# EAGLE design 1705-Servo2 (EAGLE 8.3.2)
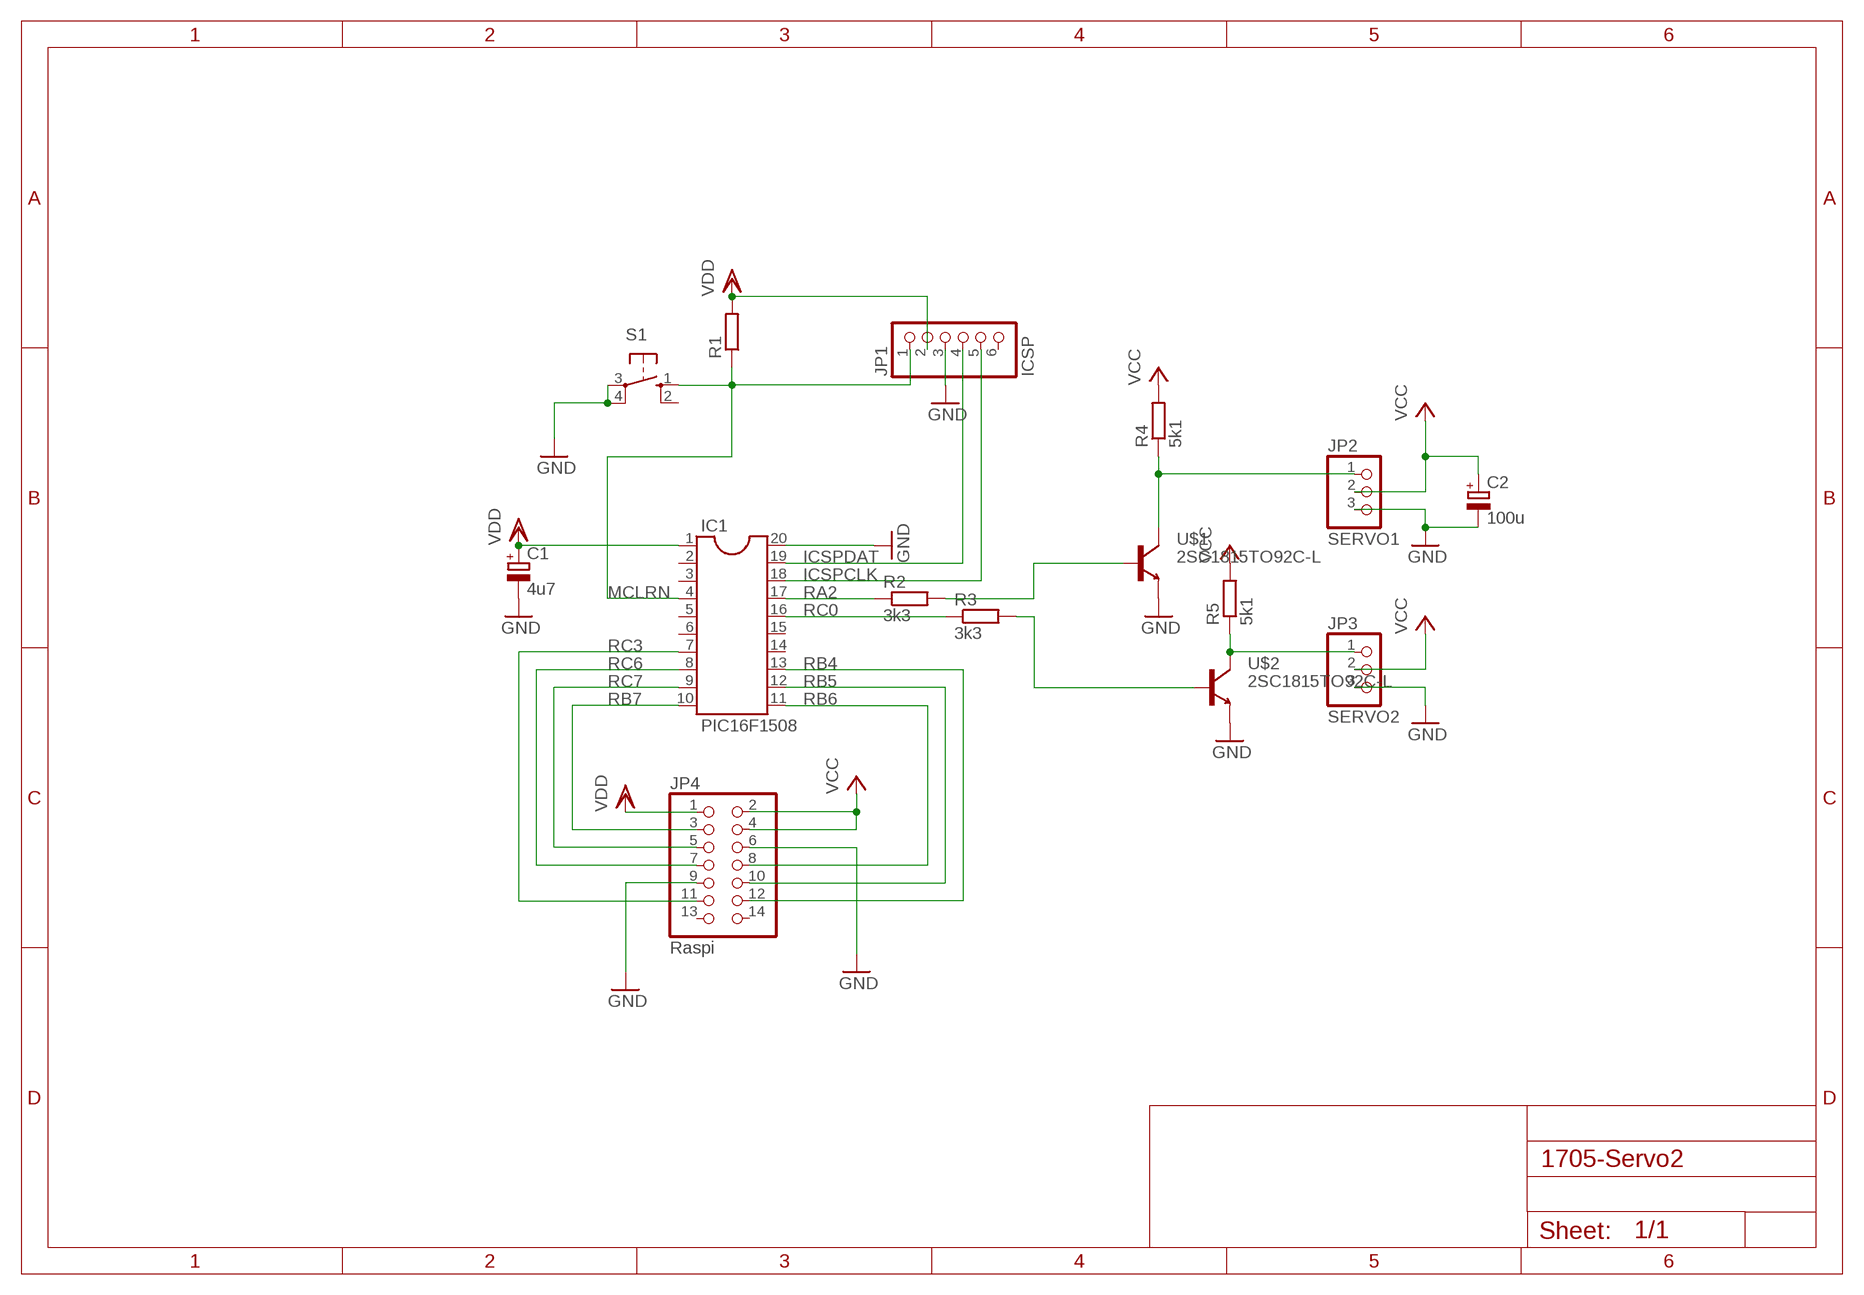
[diagram p0: schematic, sheet 1]

## Parts
C1  4u7  CPOL-EUE5-6E  [E5-6E]
C2  100u  CPOL-EUE2.5-6E  [E2,5-6E]
IC1  PIC16F1508  DIL20  [DIL20]
JP1  ICSP  PINHD-1X6  [1X06]
JP2  SERVO1  PINHD-1X3  [1X03]
JP3  SERVO2  PINHD-1X3  [1X03]
JP4  Raspi  PINHD-2X7  [2X07]
R1  R-EU_0207/2V  [0207/2V]
R2  3k3  R-EU_0204/8  [0204/8]
R3  3k3  R-EU_0204/8  [0204/8]
R4  5k1  R-EU_0207/2V  [0207/2V]
R5  5k1  R-EU_0207/2V  [0207/2V]
S1  10-XX  [B3F-10XX]
U$1  2SC1815TO92C-L  [TO92C-L]
U$2  2SC1815TO92C-L  [TO92C-L]

## Nets
GND: C1.- C2.- IC1.20 JP1.3 JP2.3 JP3.3 JP4.6 JP4.9 S1.3(P) S1.4(P1) U$1.1(E) U$2.1(E)
ICSPCLK: IC1.18 JP1.5
ICSPDAT: IC1.19 JP1.4
MCLRN: IC1.4 JP1.1 R1.1 S1.1(S)
N$5: JP2.1 R4.1 U$1.2(C)
N$6: JP3.1 R5.1 U$2.2(C)
N$7: R2.2 U$1.3(B)
N$8: R3.2 U$2.3(B)
RA2: IC1.17 R2.1
RB4: IC1.13 JP4.12
RB5: IC1.12 JP4.10
RB6: IC1.11 JP4.8
RB7: IC1.10 JP4.3
RC0: IC1.16 R3.1
RC3: IC1.7 JP4.11
RC6: IC1.8 JP4.7
RC7: IC1.9 JP4.5
VCC: C2.+ JP2.2 JP3.2 JP4.2 JP4.4 R4.2 R5.2
VDD: C1.+ IC1.1 JP1.2 JP4.1 R1.2
Unconnected: IC1.2 IC1.3 IC1.5 IC1.6 IC1.14 IC1.15 JP1.6 JP4.13 JP4.14 S1.2(S1)

## Library data of the parts
C1 C2 = mita-akiba:CPOL-EU: POLARIZED CAPACITOR, European symbol
IC1 = ic-package:DIL20: Dual In Line / Socket
JP1 = pinhead:PINHD-1X6: PIN HEADER
JP2 JP3 = pinhead:PINHD-1X3: PIN HEADER
JP4 = pinhead:PINHD-2X7: PIN HEADER
R1-R5 = mita-akiba:R-EU_*: RESISTOR, European symbol
S1 = switch-omron:10-XX: OMRON SWITCH; MPN: B3F-1000; OC_FARNELL: 176432; OC_NEWARK: 36M3542
U$1 U$2 = mita-akiba:2SC1815*: Toshiba VCEO=50V IC=150mA hFE rank: O 70-140, Y 120-240, GR 200-400, BL=350-700 Complementary to 2SA1015

## Board
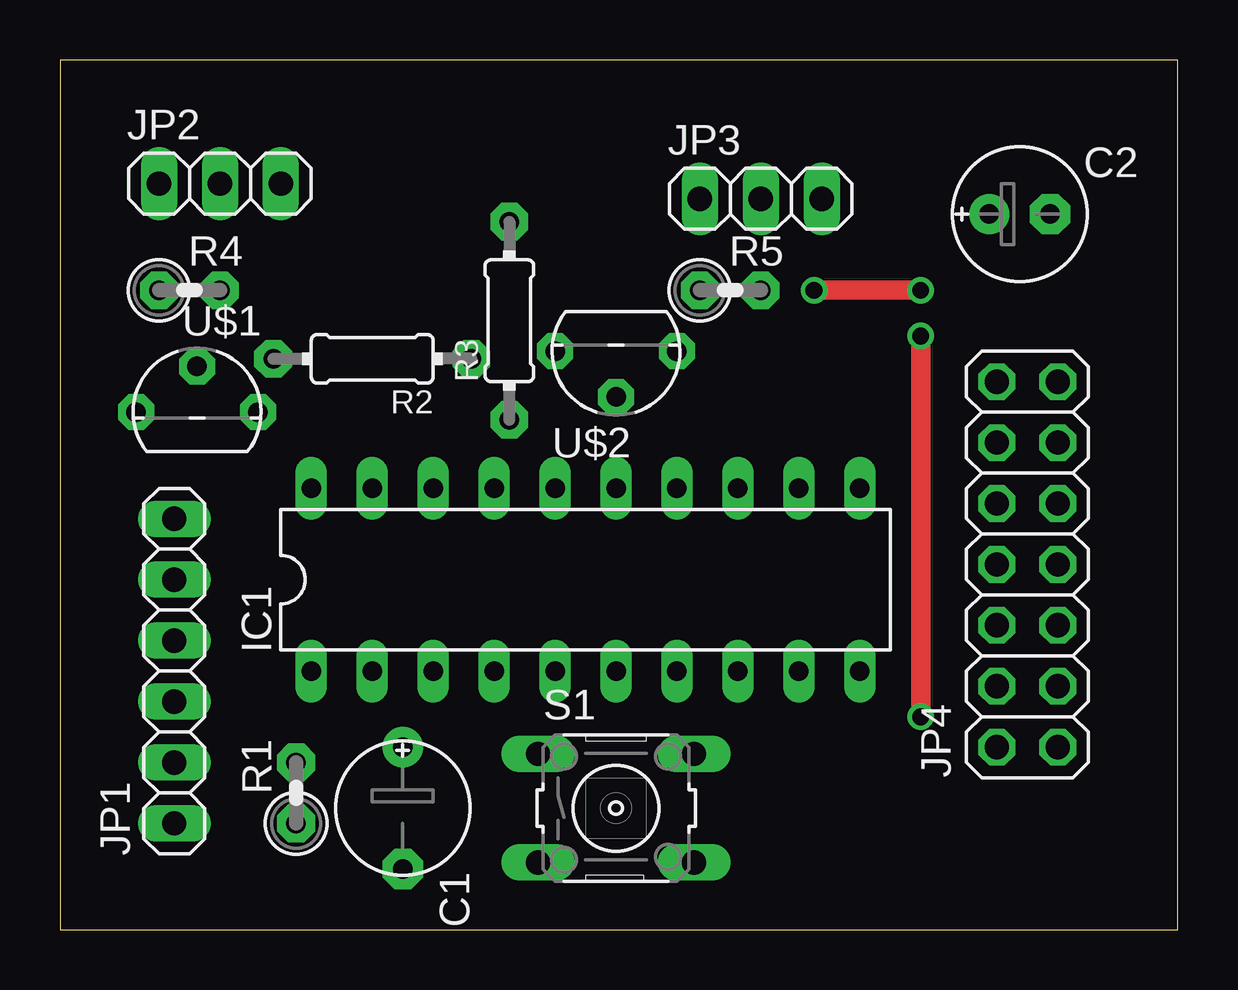
[diagram p1: board, top side]
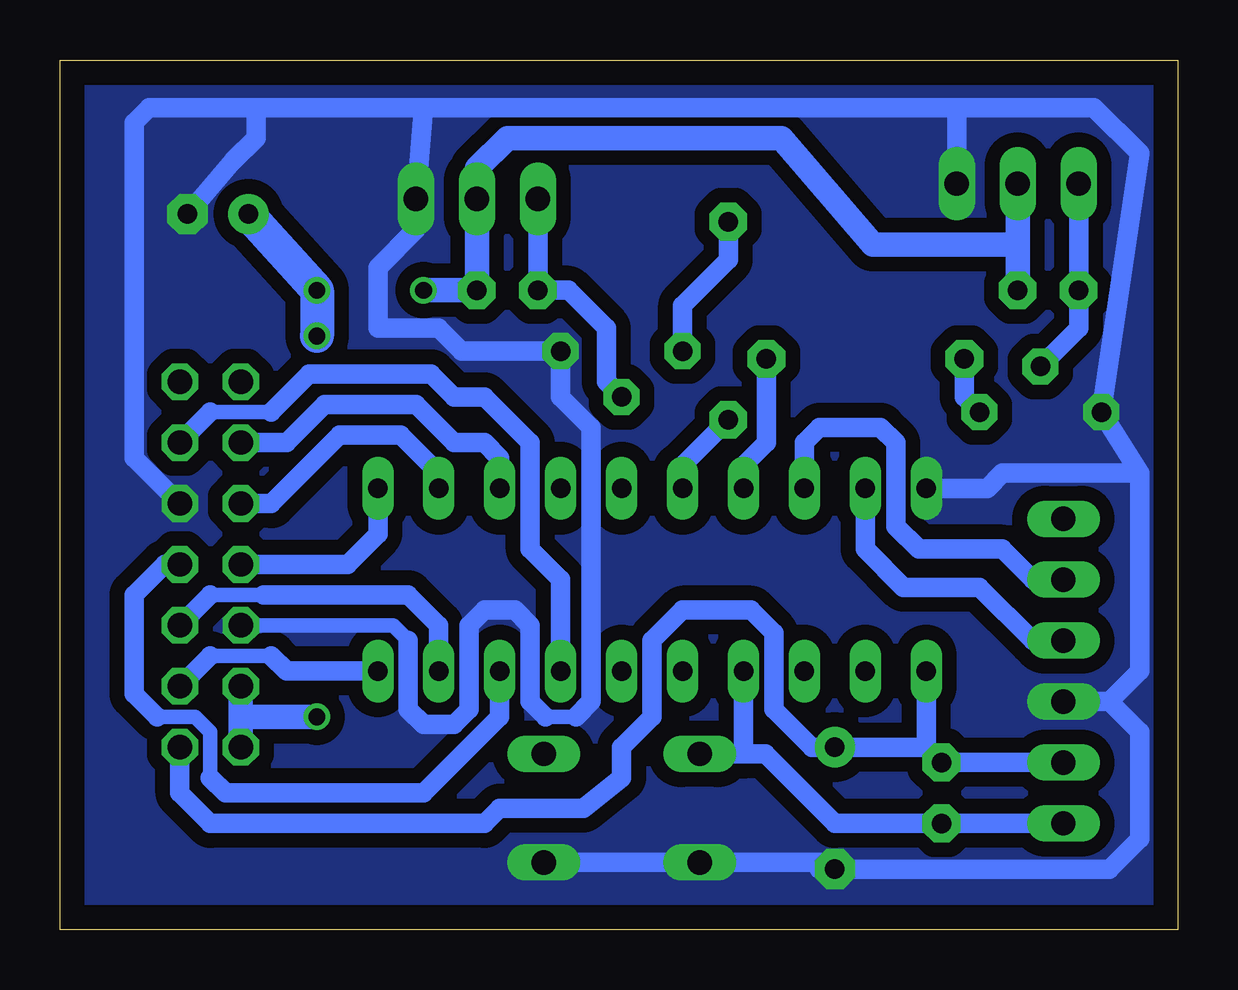
[diagram p2: board, bottom side, seen from below]

Size 46.59 x 36.27 mm. Coordinates in mm from the lower left corner, seen from the top.
Outline: 0,0 46.59,0 46.59,36.27 0,36.27 0,0
Copper layers (1*16): Top 0.035mm / dielectric 1.5mm / Bottom 0.035mm
Design rules "default": minimum track width 10mil, minimum drill 24mil, track to track 8mil, track to pad 8mil, pad to pad 8mil, via to via 8mil, smd to smd 8mil, copper to edge 40mil, drill to drill 8mil, minimum pad ring 10mil, minimum via ring 8mil, stop-mask expansion 4mil, vias tented up to drill 0mil, thermal gap 10mil

### Footprints (pad centres in the part's own frame; a part is rotated, then mirrored left to right if it is on the bottom)
E5-6E = drill 0.813 pad 1.676: + -2.54,0 | drill 0.813 pad 1.676 octagon: - 2.54,0
E2,5-6E = drill 0.813 pad 1.676: + -1.27,0 | drill 0.813 pad 1.676 octagon: - 1.27,0
DIL20 = drill 0.813 long: 1 -11.43,-3.81; 2 -8.89,-3.81; 3 -6.35,-3.81; 4 -3.81,-3.81; 5 -1.27,-3.81; 6 1.27,-3.81; 7 3.81,-3.81; 8 6.35,-3.81; 9 8.89,-3.81; 10 11.43,-3.81; 11 11.43,3.81; 12 8.89,3.81; 13 6.35,3.81; 14 3.81,3.81; 15 1.27,3.81; 16 -1.27,3.81; 17 -3.81,3.81; 18 -6.35,3.81; 19 -8.89,3.81; 20 -11.43,3.81
1X06 = drill 1.016 long: 1 -6.35,0; 2 -3.81,0; 3 -1.27,0; 4 1.27,0; 5 3.81,0; 6 6.35,0
1X03 = drill 1.016 long: 1 -2.54,0; 2 0,0; 3 2.54,0
2X07 = drill 1.016 octagon: 1 -7.62,-1.27; 2 -7.62,1.27; 3 -5.08,-1.27; 4 -5.08,1.27; 5 -2.54,-1.27; 6 -2.54,1.27; 7 0,-1.27; 8 0,1.27; 9 2.54,-1.27; 10 2.54,1.27; 11 5.08,-1.27; 12 5.08,1.27; 13 7.62,-1.27; 14 7.62,1.27
0207/2V = drill 0.813 pad 1.575 octagon: 1 -1.27,0; 2 1.27,0
0204/8 = drill 0.813 pad 1.575 octagon: 1 -4.128,0; 2 4.128,0
B3F-10XX = drill 1.016 long: 1 -3.251,2.261; 2 3.251,2.261; 3 -3.251,-2.261; 4 3.251,-2.261
TO92C-L = drill 0.813 pad 1.5 octagon: 1 -2.54,0; 2 0,1.905; 3 2.54,0

### Placement (x,y rotation side)
C1  14.29,5.08 270 top
C2  40,29.85 0 top
IC1  21.91,14.61 0 top
JP1  4.76,10.79 90 top
JP2  6.67,31.12 0 top
JP3  29.21,30.48 0 top
JP4  40.32,15.24 90 top
R1  9.84,5.71 90 top
R2  13.02,23.81 180 top
R3  18.73,25.4 90 top
R4  5.4,26.67 0 top
R5  27.94,26.67 0 top
S1  23.18,5.08 0 top
U$1  5.71,21.59 0 top
U$2  23.18,24.13 180 top

### Tracks (layer width: path | path; a pad name or v marks a point on that pad's centre or on a via)
GND
  Bottom 0.61: JP4.6 32.7,12.7 32.07,12.06 | 25.08,8.89 26.35,8.89
  Bottom 0.813: 2.86,9.53 JP1.3 | 2.86,9.53 1.59,8.26 1.59,3.81 2.86,2.54 C1.- | C1.- 14.92,2.54 | C1.- 14.57,2.82 S1.3 S1.4 | IC1.20 7.94,18.42 7.3,19.05 1.59,19.05 | 1.59,19.05 1.59,10.79 2.86,9.53 | 1.59,19.05 U$1.1 1.59,32.38 3.49,34.29 9.21,34.29 | 9.21,34.29 31.43,34.29 | 31.43,34.29 38.42,34.29 | 31.43,34.29 JP3.3 31.75,29.21 33.34,27.62 33.34,25.08 30.8,25.08 29.85,24.13 U$2.1 25.72,22.23 24.45,20.96 24.45,9.53 25.08,8.89 | 9.21,34.29 JP2.3 | 38.42,34.29 38.42,33.02 39.37,32.07 C2.- | 38.42,34.29 42.86,34.29 43.5,33.66 43.5,19.69 JP4.9 | 32.07,12.06 32.07,9.21 31.43,8.57 30.16,8.57 29.53,9.21 29.53,12.7 28.89,13.33 27.62,13.33 26.99,12.7 26.99,9.53 26.35,8.89
  pour Bottom (isolate 0.61, no thermals): 0,0.32 46.67,0.32 46.67,36.2 0,36.2
ICSPCLK
  Bottom 0.813: IC1.18 15.56,20.32 14.92,20.96 12.38,20.96 11.75,20.32 11.75,16.83 10.8,15.88 7.3,15.88 6.03,14.61 JP1.5
ICSPDAT
  Bottom 0.813: JP1.4 6.03,12.06 8.25,14.29 11.43,14.29 13.02,15.88 IC1.19
MCLRN
  Bottom 0.813: JP1.1 R1.1 14.29,4.45 17.18,7.34 18.1,7.34 | 18.1,7.34 S1.1 | 18.1,7.34 IC1.4
N$5
  Bottom 0.813: JP2.1 R4.1 4.13,25.08 U$1.2
N$6
  Bottom 0.813: U$2.2 23.81,22.86 23.81,25.08 25.4,26.67 R5.1 JP3.1
N$7
  Bottom 0.813: U$1.3 8.89,22.23 R2.2
N$8
  Bottom 0.813: U$2.3 20.64,26.04 18.73,27.94 R3.2
RA2
  Bottom 0.813: IC1.17 18.1,19.37 17.14,20.32 R2.1
RB4
  Bottom 0.813: IC1.13 28.26,19.69 28.89,20.32 30.16,20.32 31.75,21.91 35.56,21.91 37.15,20.32 JP4.12
RB5
  Bottom 0.813: IC1.12 30.8,19.05 32.39,20.64 34.92,20.64 37.78,17.78 JP4.10
RB6
  Bottom 0.813: JP4.8 34.61,15.24 33.34,16.51 IC1.11
RB7
  Bottom 0.61: 37.78,11.43 40.32,11.43
  Bottom 0.813: 40.32,11.43 JP4.3 | 37.78,11.43 37.15,10.79 IC1.10
RC0
  Bottom 0.813: IC1.16 20.64,19.37 R3.1
RC3
  Bottom 0.61: 37.78,21.59 40.32,21.59
  Bottom 0.813: IC1.7 25.72,14.61 26.99,15.88 26.99,20.32 28.89,22.23 30.16,22.23 31.12,23.18 36.2,23.18 37.78,21.59 | 40.32,21.59 JP4.11
RC6
  Bottom 0.61: 42.54,8.89 40.96,8.89 40.32,8.26 40.32,6.35
  Bottom 0.813: JP4.7 42.23,15.24 43.5,13.97 43.5,9.84 42.54,8.89 | 40.32,6.35 39.69,5.71 31.43,5.71 28.26,8.89 IC1.8
RC7
  Bottom 0.61: 38.1,13.97 40.32,13.97
  Bottom 0.813: 40.32,13.97 JP4.5 | 38.1,13.97 32.07,13.97 30.8,12.7 IC1.9
VCC  (via drill 0.7)
  Top 0.813: v31.43,26.67 v35.88,26.67 | v35.88,24.77 v35.88,8.89
  Bottom 0.813: 29.21,31.75 JP3.2
  Bottom 1.016: R4.2 6.67,28.58 | 6.67,28.58 JP2.2 | 6.67,28.58 12.7,28.58 16.51,33.02 27.94,33.02 29.21,31.75 | JP3.2 R5.2 v31.43,26.67 | v35.88,8.89 39.05,8.89 | 39.05,8.89 JP4.4 | 39.05,8.89 JP4.2
  Bottom 1.422: C2.+ v35.88,26.67 v35.88,24.77
VDD
  Bottom 0.813: 10.48,7.62 R1.2 JP1.2 | 10.48,7.62 C1.+ 15.24,7.62 16.83,9.21 16.83,12.38 17.78,13.33 20.64,13.33 21.91,12.06 21.91,8.89 23.18,7.62 23.18,6.35 24.76,5.08 28.26,5.08 28.89,4.45 40.32,4.45 41.59,5.71 JP4.1 | 10.48,7.62 IC1.1